# EAGLE design hc_05 (EAGLE 9.6.1)
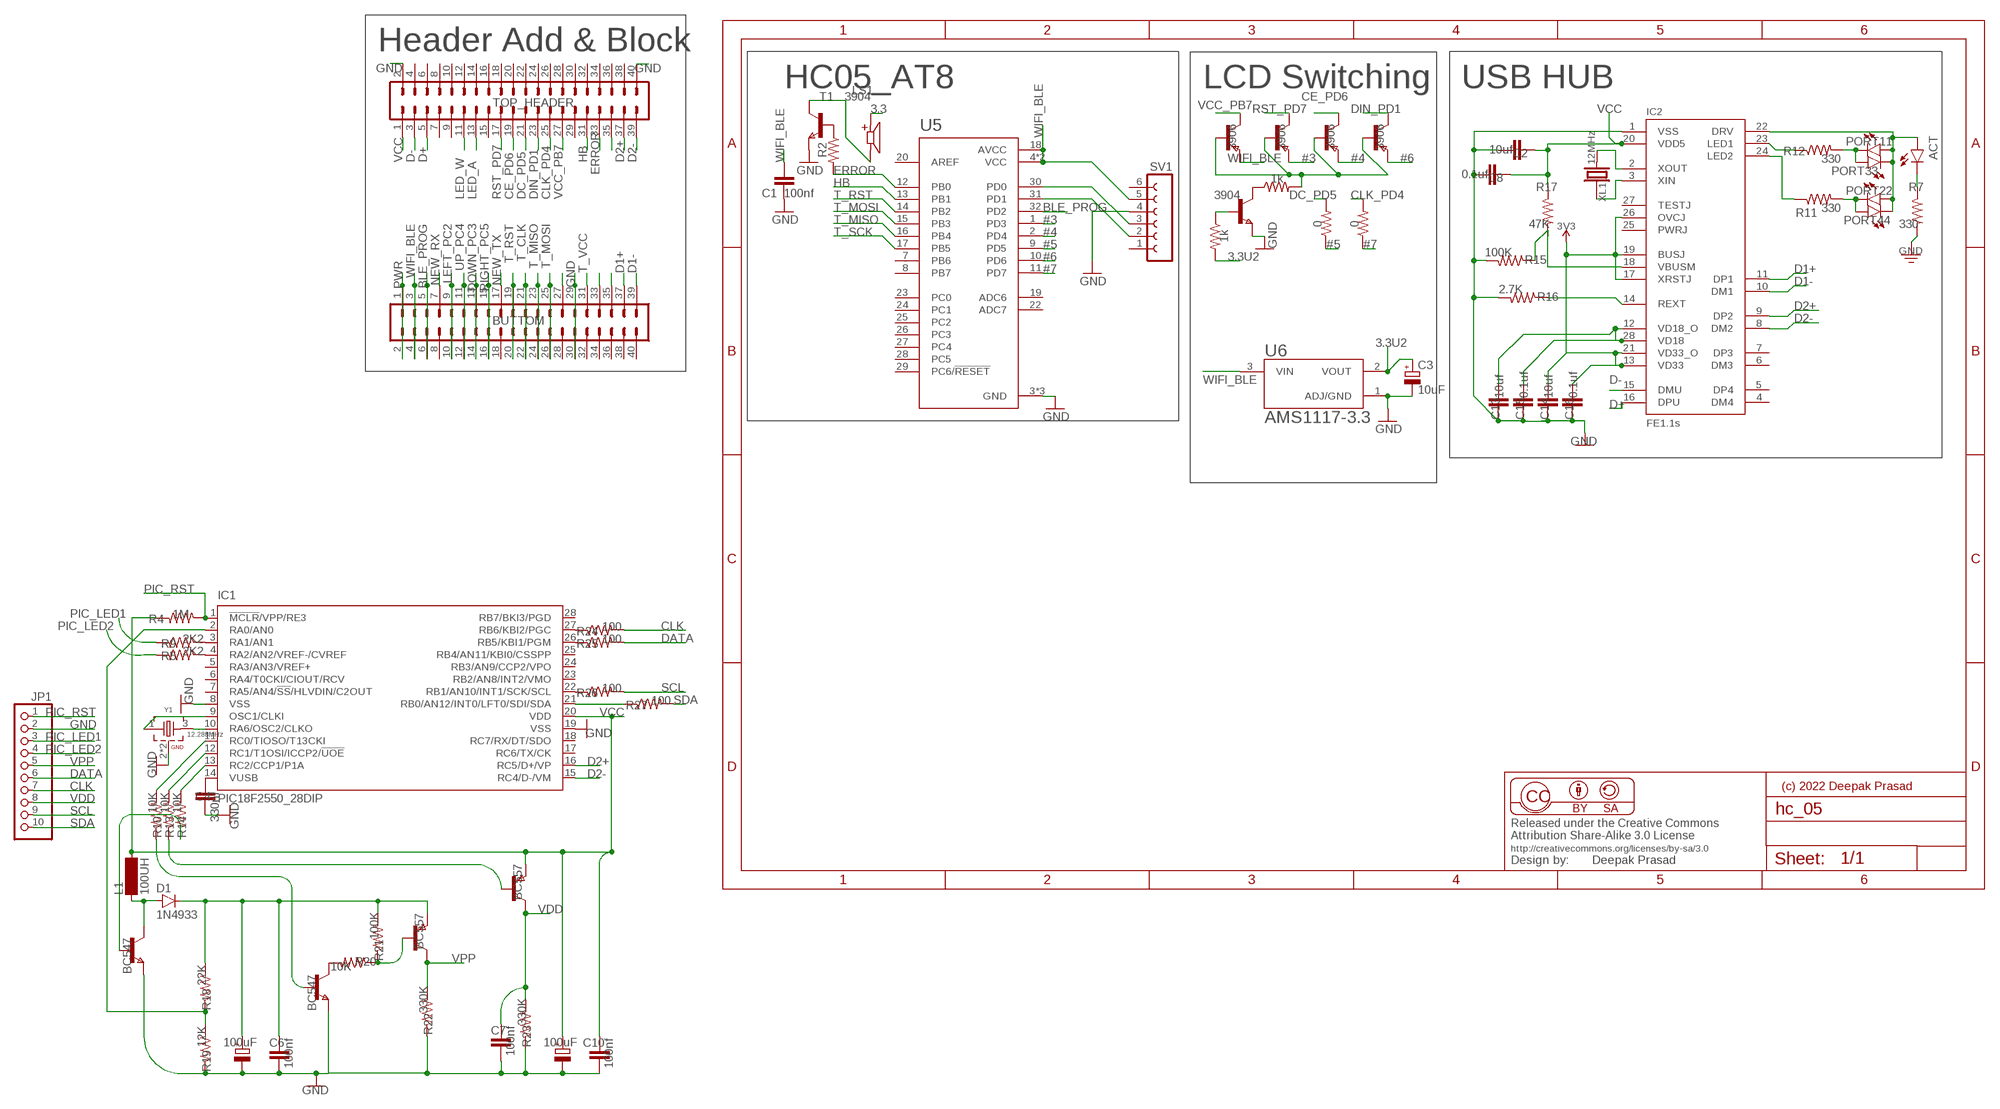
[diagram p0: schematic, sheet 1]

## Parts
ACT  LED1206  [LED-1206]
BUTTOM  MA20-2  [MA20-2]
C1  100nf  C-EUC1206  [C1206]
C2  10uf  C-EUC1206  [C1206]
C3  10uF  CPOL-EUC/6032-28R  [C/6032-28R]
C4  330nf  C-EUC1206  [C1206]
C5  100uF  CPOL-EUC/6032-28R  [C/6032-28R]
C6  100nf  C-EUC1206  [C1206]
C7  100nf  C-EUC1206  [C1206]
C8  0.1uf  C-EUC1206  [C1206]
C9  100uF  CPOL-EUC/6032-28R  [C/6032-28R]
C10  100nf  C-EUC1206  [C1206]
C13  10uf  C-EUC1206  [C1206]
C14  10uf  C-EUC1206  [C1206]
C15  0.1uf  C-EUC1206  [C1206]
C16  0.1uf  C-EUC1206  [C1206]
D1  1N4933  D-SMB  [SMB]
IC1  PIC18F2550_28DIP  [DIL28-3]
IC2  FE1.1S  [FE1.1S_SSOP-28]
JP1  PINHD-1X10  [1X10]
L1  100UH  MS85  [MS85]
LS1  CMT-8530S-SMT  [CUI_CMT-8530S-SMT]
PORT11  LED1206  [LED-1206]
PORT22  LED1206  [LED-1206]
PORT33  LED1206  [LED-1206]
PORT44  LED1206  [LED-1206]
R1  1k  R-US_CHIP-1206(3216-METRIC)  [RESC3216X70]
R2  22  R-US_CHIP-1206(3216-METRIC)  [RESC3216X70]
R3  0  R-US_CHIP-1206(3216-METRIC)  [RESC3216X70]
R4  1M  R-US_CHIP-1206(3216-METRIC)  [RESC3216X70]
R5  2K2  R-US_CHIP-1206(3216-METRIC)  [RESC3216X70]
R6  1k  R-US_CHIP-1206(3216-METRIC)  [RESC3216X70]
R7  330  R-US_CHIP-1206(3216-METRIC)  [RESC3216X70]
R8  0  R-US_CHIP-1206(3216-METRIC)  [RESC3216X70]
R9  2K2  R-US_CHIP-1206(3216-METRIC)  [RESC3216X70]
R10  10K  R-US_CHIP-1206(3216-METRIC)  [RESC3216X70]
R11  330  R-US_CHIP-1206(3216-METRIC)  [RESC3216X70]
R12  330  R-US_CHIP-1206(3216-METRIC)  [RESC3216X70]
R13  10K  R-US_CHIP-1206(3216-METRIC)  [RESC3216X70]
R14  10K  R-US_CHIP-1206(3216-METRIC)  [RESC3216X70]
R15  100K  R-US_CHIP-1206(3216-METRIC)  [RESC3216X70]
R16  2.7K  R-US_CHIP-1206(3216-METRIC)  [RESC3216X70]
R17  47K  R-US_CHIP-1206(3216-METRIC)  [RESC3216X70]
R18  22K  R-US_CHIP-1206(3216-METRIC)  [RESC3216X70]
R19  12K  R-US_CHIP-1206(3216-METRIC)  [RESC3216X70]
R20  10K  R-US_CHIP-1206(3216-METRIC)  [RESC3216X70]
R21  100K  R-US_CHIP-1206(3216-METRIC)  [RESC3216X70]
R22  330K  R-US_CHIP-1206(3216-METRIC)  [RESC3216X70]
R23  330K  R-US_CHIP-1206(3216-METRIC)  [RESC3216X70]
R24  100  R-US_CHIP-1206(3216-METRIC)  [RESC3216X70]
R25  100  R-US_CHIP-1206(3216-METRIC)  [RESC3216X70]
R26  100  R-US_CHIP-1206(3216-METRIC)  [RESC3216X70]
R27  100  R-US_CHIP-1206(3216-METRIC)  [RESC3216X70]
SV1  FE06-1  [FE06]
T1  3904  NPNSOT23  [SOT-23]
T2  3904  NPNSOT23  [SOT-23]
T3  3906  PNPSOT23  [SOT-23]
T4  3906  PNPSOT23  [SOT-23]
T5  3906  PNPSOT23  [SOT-23]
T6  3906  PNPSOT23  [SOT-23]
T7  BC547  NPNSOT23  [SOT-23]
T8  BC557  PNPSOT23  [SOT-23]
T9  BC547  NPNSOT23  [SOT-23]
T10  BC557  PNPSOT23  [SOT-23]
TOP_HEADER  MA20-2  [MA20-2]
U5  ATMEGA328P-AU  [QFP80P900X900X120-32N]
U6  AMS1117-3.3  [SOT229P700X180-4N]
XL1  12MHz  CRYSTALHC49UP  [HC49UP]
Y1  12.288MHz  WE-XTAL_CFPX-104_830059523  [WE-XTAL_CFPX-104]

## Nets
3.3: LS1.P
3.3U2: C3.+ R6.2 U6.2(VOUT)
3V3: C14.2 C16.2 IC2.13(VD33) IC2.17(XRSTJ) IC2.19(BUSJ) IC2.21(VD33_O) IC2.26(OVCJ)
#3: T4.2(E) U5.1(PD3)
#4: T5.2(E) U5.2(PD4)
#5: R8.1 U5.9(PD5)
#6: T6.2(E) U5.10(PD6)
#7: R3.1 U5.11(PD7)
BLE_PROG: BUTTOM.5 BUTTOM.6 U5.32(PD2)
CE_PD6: T5.1(C) TOP_HEADER.19
CLK: JP1.7 R24.2
CLK_PD4: R3.2 TOP_HEADER.25
D1+: BUTTOM.37 IC2.11(DP1)
D1-: BUTTOM.39 IC2.10(DM1)
D2+: IC1.16(RC5/D+/VP) IC2.9(DP2) TOP_HEADER.37
D2-: IC1.15(RC4/D-/VM) IC2.8(DM2) TOP_HEADER.39
D+: IC2.16(DPU) TOP_HEADER.5
D-: IC2.15(DMU) TOP_HEADER.3
DATA: JP1.6 R25.2
DC_PD5: R8.2 TOP_HEADER.21
DIN_PD1: T6.1(C) TOP_HEADER.23
DOWN_PC3: BUTTOM.13 BUTTOM.14
ERROR: R2.2 TOP_HEADER.33 U5.12(PB0)
GND [POWER]: BUTTOM.29 BUTTOM.30 C1.1 C2.2 C3.- C4.1 C5.- C6.1 C7.1 C8.2 C9.- C10.1 C13.1 C14.1 C15.1 C16.1 IC1.8(VSS) IC1.19(VSS) IC2.1(VSS) JP1.2 R7.2 R15.2 R16.2 R19.1 R22.1 R23.1 SV1.4 T1.2(E) T2.2(E) T7.2(E) T9.2(E) TOP_HEADER.2 TOP_HEADER.40 U5.3(GND) U5.5(GND) U5.21(GND) U6.1(ADJ/GND) Y1.2(GND) Y1.4(GND)
HB: TOP_HEADER.31 U5.13(PB1)
LED_A: TOP_HEADER.13
LED_W: TOP_HEADER.11
LEFT_PC2: BUTTOM.9 BUTTOM.10
N$1: R1.1 T2.1(C)
N$2: R1.2 T3.3(B) T4.3(B) T5.3(B) T6.3(B)
N$3: IC1.27(RB6/KBI2/PGC) R24.1
N$4: R2.1 T1.3(B)
N$5: IC1.4(RA2/AN2/VREF-/CVREF) R5.2
N$6: IC1.3(RA1/AN1) R9.2
N$7: IC1.9(OSC1/CLKI) Y1.1
N$8: IC1.10(RA6/OSC2/CLKO) Y1.3
N$9: IC1.11(RC0/TIOSO/T13CKI) R10.2
N$10: IC1.12(RC1/T1OSI/ICCP2/!UOE) R13.2
N$11: IC1.13(RC2/CCP1/P1A) R14.2
N$12: C4.2 IC1.14(VUSB)
N$13: R10.1 T9.3(B)
N$14: SV1.2 U5.31(PD1)
N$15: SV1.3 U5.30(PD0)
N$16: R6.1 T2.3(B)
N$17: IC2.14(REXT) R16.1
N$18: ACT.C R7.1
N$19: D1.2(A) L1.1 T7.1(C)
N$20: C13.2 C15.2 IC2.12(VD18_O) IC2.28(VD18)
N$21: C5.+ C6.2 D1.1(C) R18.2 R21.2 T10.2(E)
N$22: R14.1 T7.3(B)
N$23: LS1.N T1.1(C)
N$24: IC2.23(LED1) R12.1
N$25: IC2.2(XOUT) XL1.2
N$26: IC2.3(XIN) XL1.1
N$27: PORT11.C PORT33.A R12.2
N$28: PORT22.C PORT44.A R11.2
N$29: IC1.2(RA0/AN0) R18.1 R19.2
N$30: R13.1 T8.3(B)
N$31: R20.2 T9.1(C)
N$32: TOP_HEADER.35
N$33: R20.1 R21.1 T10.3(B)
N$34: IC1.26(RB5/KBI1/PGM) R25.1
N$35: IC1.22(RB1/AN10/INT1/SCK/SCL) R26.1
N$36: IC1.21(RB0/AN12/INT0/LFT0/SDI/SDA) R27.1
N$38: IC2.18(VBUSM) R15.1 R17.2
N$41: BUTTOM.27
N$44: BUTTOM.33
N$45: BUTTOM.35
N$48: IC2.24(LED2) R11.1
N$49: ACT.A IC2.22(DRV) PORT11.A PORT22.A PORT33.C PORT44.C
NEW_RX: BUTTOM.7
NEW_TX: BUTTOM.17
PIC_LED1: JP1.3 R9.1
PIC_LED2: JP1.4 R5.1
PIC_RST: IC1.1(!MCLR!/VPP/RE3) JP1.1 R4.2
PWR: BUTTOM.1 BUTTOM.2
RIGHT_PC5: BUTTOM.15 BUTTOM.16
RST_PD7: T4.1(C) TOP_HEADER.17
SCL: JP1.9 R26.2
SDA: JP1.10 R27.2
T_CLK: BUTTOM.21 BUTTOM.22
T_MISO: BUTTOM.23 BUTTOM.24 U5.16(PB4)
T_MOSI: BUTTOM.25 BUTTOM.26 U5.15(PB3)
T_RST: BUTTOM.19 BUTTOM.20 U5.14(PB2)
T_SCK: U5.17(PB5)
T_VCC: BUTTOM.31
UP_PC4: BUTTOM.11 BUTTOM.12
VCC [POWER]: C2.1 C8.1 C9.+ C10.2 IC1.20(VDD) IC2.20(VDD5) L1.2 R4.1 R17.1 T8.2(E) TOP_HEADER.1
VCC_PB7: T3.1(C) TOP_HEADER.27
VDD: C7.2 JP1.8 R23.2 T8.1(C)
VPP: JP1.5 R22.2 T10.1(C)
WIFI_BLE: BUTTOM.3 BUTTOM.4 C1.2 SV1.5 T3.2(E) U5.4(VCC) U5.6(VCC) U5.18(AVCC) U6.3(VIN)
Unconnected: BUTTOM.8 BUTTOM.18 BUTTOM.28 BUTTOM.32 BUTTOM.34 BUTTOM.36 BUTTOM.38 BUTTOM.40 IC1.5(RA3/AN3/VREF+) IC1.6(RA4/T0CKI/CIOUT/RCV) IC1.7(RA5/AN4/!SS!/HLVDIN/C2OUT) IC1.17(RC6/TX/CK) IC1.18(RC7/RX/DT/SDO) IC1.23(RB2/AN8/INT2/VMO) IC1.24(RB3/AN9/CCP2/VPO) IC1.25(RB4/AN11/KBI0/CSSPP) IC1.28(RB7/BKI3/PGD) IC2.4(DM4) IC2.5(DP4) IC2.6(DM3) IC2.7(DP3) IC2.25(PWRJ) IC2.27(TESTJ) SV1.1 SV1.6 TOP_HEADER.4 TOP_HEADER.6 TOP_HEADER.7 TOP_HEADER.8 TOP_HEADER.9 TOP_HEADER.10 TOP_HEADER.12 TOP_HEADER.14 TOP_HEADER.15 TOP_HEADER.16 TOP_HEADER.18 TOP_HEADER.20 TOP_HEADER.22 TOP_HEADER.24 TOP_HEADER.26 TOP_HEADER.28 TOP_HEADER.29 TOP_HEADER.30 TOP_HEADER.32 TOP_HEADER.34 TOP_HEADER.36 TOP_HEADER.38 U5.7(PB6) U5.8(PB7) U5.19(ADC6) U5.20(AREF) U5.22(ADC7) U5.23(PC0) U5.24(PC1) U5.25(PC2) U5.26(PC3) U5.27(PC4) U5.28(PC5) U5.29(PC6/!RESET)

## Notes on the sheet
- Header Add & Block
- HC05_AT8 | LCD Switching | USB HUB
- (c) 2022 Deepak Prasad

## Library data of the parts
ACT PORT11 PORT22 PORT33 PORT44 = SparkFun-LED:LED: LED (Generic) Standard schematic elements and footprints for 5mm, 3mm, 1206, and 0603 sized LEDs. Generic LEDs with no color specified.
BUTTOM TOP_HEADER = con-lstb:MA20-2: PIN HEADER; OC_FARNELL: unknown; OC_NEWARK: unknown
C1 C2 C4 C6-C8 C10 C13-C16 = rcl:C-EU: CAPACITOR, European symbol; SPICEPREFIX: C
C3 C5 C9 = rcl:CPOL-EU: POLARIZED CAPACITOR, European symbol
D1 = semicon-smd-ipc:D-: DIODE unfilled
IC1 = microchip:PIC18F2*_28: USB Microcontrollers with nanoWatt Technology High-Performance, Enhanced Flash, 28/40/44-Pin, Source: http://ww1.microchip.com/downloads/en/devicedoc/39632c.pdf; MF: MICROCHIP; MPN: PIC18F2550-I/SP; OC_FARNELL: 1523822; OC_NEWARK: 80K6054
IC2 = Ai_IC:FE1.1S
JP1 = pinhead:PINHD-1X10: PIN HEADER
L1 = inductor-neosid:MS85: INDUCTOR SMD power inductor; OC_FARNELL: unknown; OC_NEWARK: unknown
LS1 = CMT-8530S-SMT:CMT-8530S-SMT: 8.5 mm, 3.6 Vo-p, 90 dB, Surface Mount (SMT), Magnetic Audio Transducer Buzzer Check availability <https://pricing.snapeda.com/parts/CMT-8530S-SMT-TR/CUI%20Devices/view-part?ref=eda>; AVAILABILITY: In Stock; CUI_PURCHASE_URL: https://www.cuidevices.com/product/audio/buzzers/audio-transducers/cmt-8530s-smt-tr?utm_source=snapeda.com&utm_medium=referral&utm_campaign=snapedaBOM; DESCRIPTION: 8.5 mm, 3.6 Vo-p, 90 dB, Surface Mount (SMT), Magnetic Audio Transducer Buzzer; MF: CUI Devices; MP: CMT-8530S-SMT-TR; PACKAGE: None; PRICE: None; PURCHASE-URL: https://pricing.snapeda.com/search/part/CMT-8530S-SMT-TR/?ref=eda
R1-R27 = Resistor:R-US: Resistor Fixed - ANSI; CATEGORY: Resistor; SUB-CATEGORY: Fixed
SV1 = con-lsta:FE06-1: FEMALE HEADER; OC_FARNELL: unknown; OC_NEWARK: unknown
T1 T2 T7 T9 = zetex:NPNSOT23: NPN TRANSISTOR; MPN: DSS20201L-7; OC_FARNELL: 1710688; OC_NEWARK: 25R4555
T3-T6 T8 T10 = zetex:PNPSOT23: PNP TRANSISTOR; MPN: DSS20200L-7; OC_FARNELL: unknown; OC_NEWARK: 25R4554
U5 = ATMEGA328P-AU:ATMEGA328P-AU: ATmega Series 20 MHz 32 KB Flash 2 KB SRAM 8-Bit Microcontroller - TQFP-32 Check availability <https://pricing.snapeda.com/parts/ATMEGA328P-AU/Microchip%20Technology/view-part?ref=eda>; AVAILABILITY: In Stock; DESCRIPTION: AVR AVR® ATmega Microcontroller IC 8-Bit 20MHz 32KB (16K x 16) FLASH 32-TQFP (7x7); MF: Microchip Technology; MP: ATMEGA328P-AU; PACKAGE: TQFP-32 Microchip; PRICE: None; PURCHASE-URL: https://pricing.snapeda.com/search/part/ATMEGA328P-AU/?ref=eda
U6 = AMS1117-3.3:AMS1117-3.3: Sot223/Pkg 1-Amp 3.3-Volt Low Drop Out Voltage Regulatator Check availability <https://pricing.snapeda.com/parts/AMS1117-3.3/Advanced%20Monolithic%20Systems/view-part?ref=eda>; AVAILABILITY: In Stock; DESCRIPTION: Sot223/Pkg 1-Amp 3.3-Volt Low Drop Out Voltage Regulatator; MF: Advanced Monolithic Systems; MP: AMS1117-3.3; PACKAGE: SOT-223 Seeed Technology; PRICE: None
XL1 = Ai_FrequencyControl:CRYSTAL: PTH: ... SMD: ... Cylinder: CMR200T-32.768KDZBT
Y1 = Wurth_Quartz Crystals & Oscillators_WE-XTAL:WE-XTAL_CFPX-104: WE-XTAL Quartz Crystal Characteristics SMT and THT models Hermetically sealed Frequencies between 1.8432 MHz and 50 MHz Tolerances down to ±10 ppm available Maximum operating temperatures range: -40 °C to 85 °C Stabilities down to ±10 ppm available Applications Microprocessor Wireless Communication Devices Industrial Devices Wired Communication (e.g. Ethernet and USB) IoT Optical Network Audio and Multimedia Devices Test and Measurement Equipment Navigation and Locators Wearables <https://www.we-online.com/catalog/media/o135919v209%20Family_WE-XTAL_IQXC-42.jpg> Details see: https://www.we-online.com/catalog/en/WE-XTAL Updated by Ella Wu , 2020-11-23 2020 (C) Wurth Elektronik; C-LOAD: 18pF; DATASHEET-URL: https://www.we-online.com/catalog/datasheet/830059523.pdf; MOUNT: SMT; PART-NUMBER: 830059523; STABILITY: 30ppm; TOLERANCE: ±20ppm

## Net classes
0 default: width 0.254 mm, clearance 0.254 mm
1 POWER: width 0.254 mm, clearance 0.254 mm

## Board
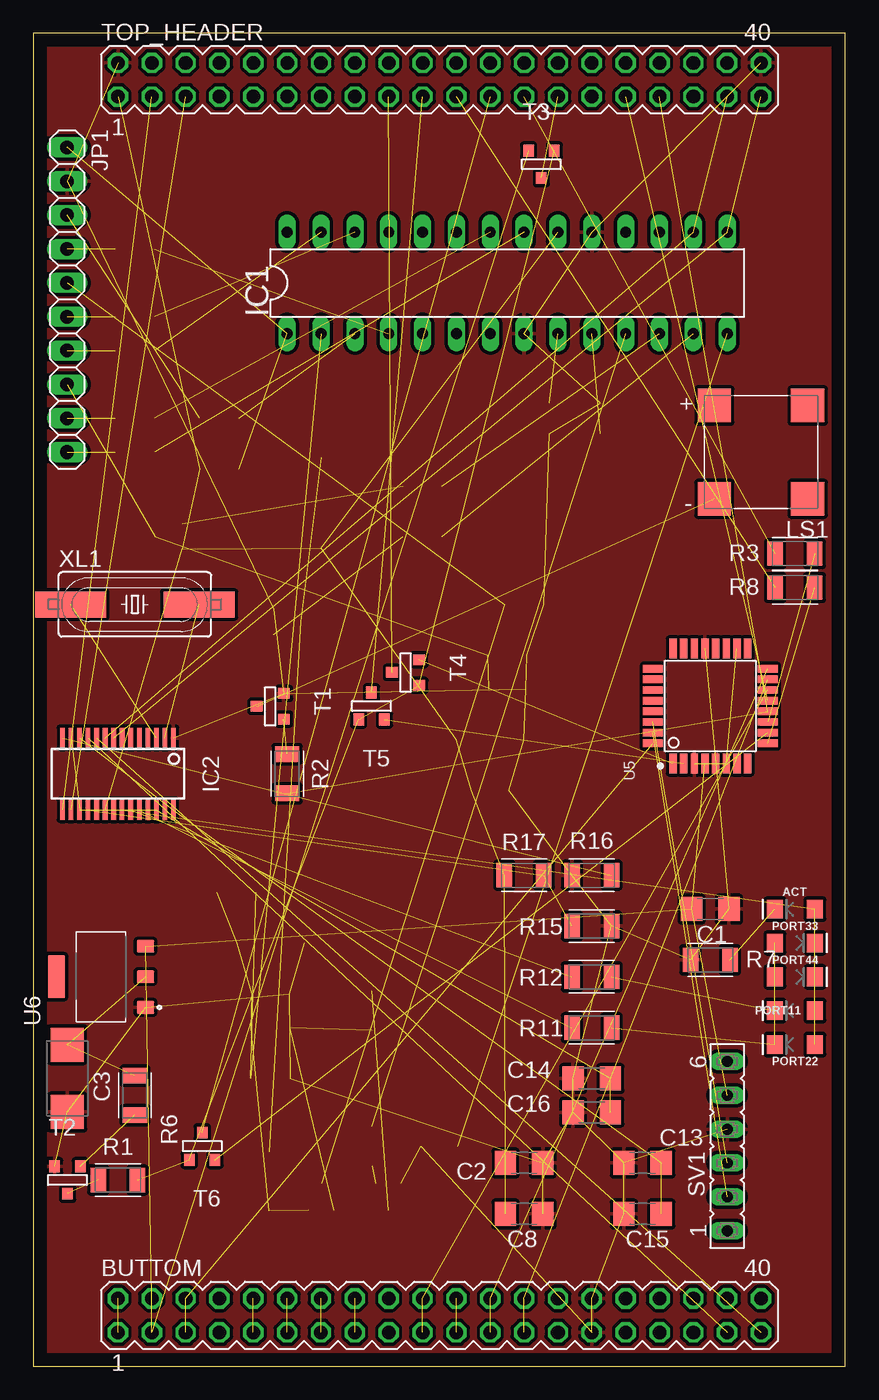
[diagram p1: board, top side]
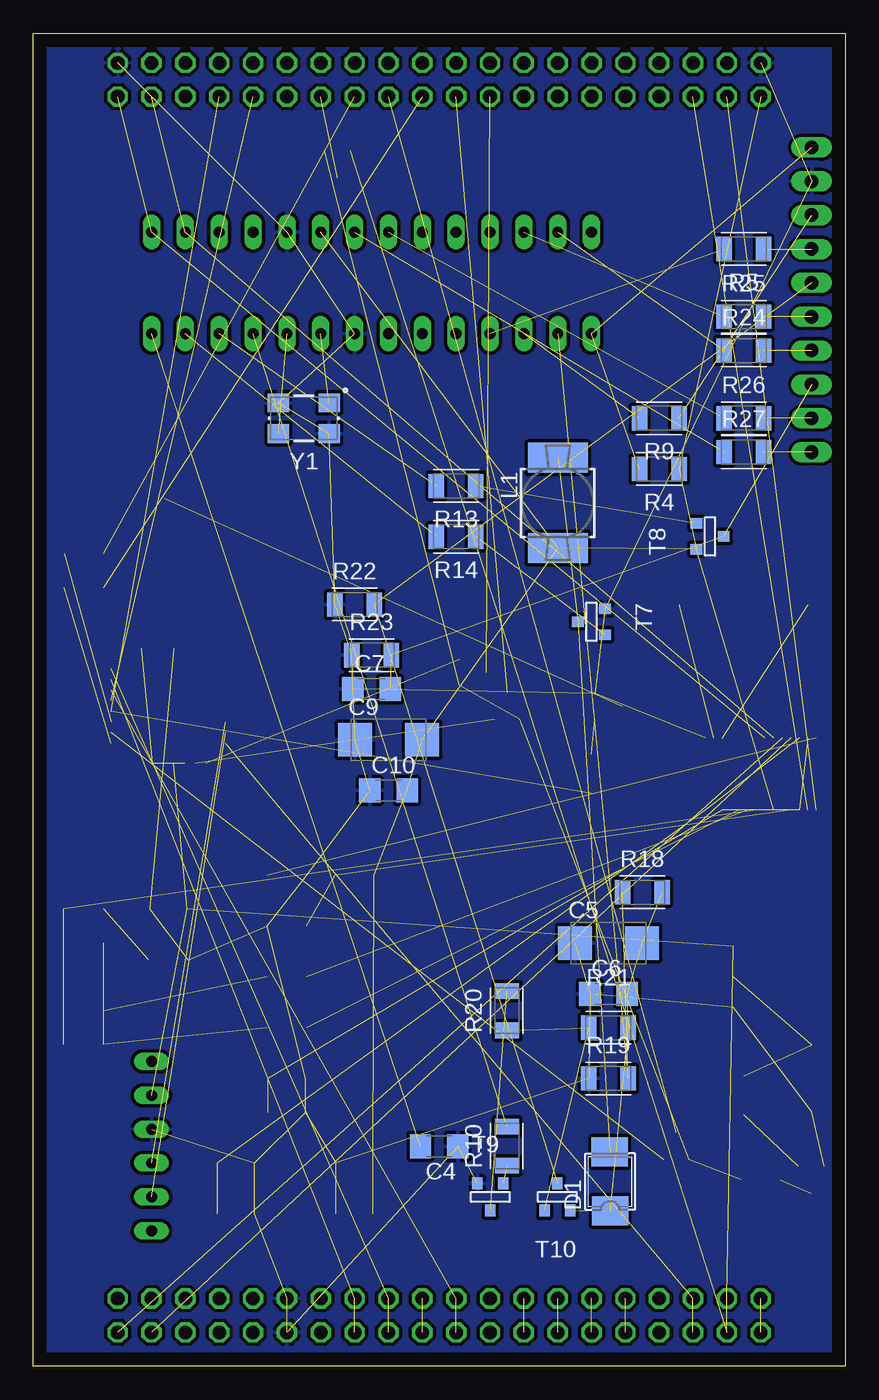
[diagram p2: board, bottom side, seen from below]

Size 60.94 x 100 mm. Coordinates in mm from the lower left corner, seen from the top.
Outline: 0,0 60.94,0 60.94,100 0,100 0,0
Copper layers (1*16): Top 0.035mm / dielectric 1.5mm / Bottom 0.035mm
Design rules "default": minimum track width 6mil, minimum drill 0.35mm, track to track 6mil, track to pad 6mil, pad to pad 6mil, via to via 6mil, smd to smd 6mil, copper to edge 40mil, drill to drill 6mil, minimum pad ring 10mil, minimum via ring 8mil, stop-mask expansion 4mil, vias tented up to drill 0mil, thermal gap 10mil

### Footprints (pad centres in the part's own frame; a part is rotated, then mirrored left to right if it is on the bottom)
LED-1206 = smd 1.2 x 1.4: A -1.5,0; C 1.5,0
MA20-2 = drill 1.016 octagon: 1 -24.13,-1.27; 2 -24.13,1.27; 3 -21.59,-1.27; 4 -21.59,1.27; 5 -19.05,-1.27; 6 -19.05,1.27; 7 -16.51,-1.27; 8 -16.51,1.27; 9 -13.97,-1.27; 10 -13.97,1.27; 11 -11.43,-1.27; 12 -11.43,1.27; 13 -8.89,-1.27; 14 -8.89,1.27; 15 -6.35,-1.27; 16 -6.35,1.27; 17 -3.81,-1.27; 18 -3.81,1.27; 19 -1.27,-1.27; 20 -1.27,1.27; 21 1.27,-1.27; 22 1.27,1.27; 23 3.81,-1.27; 24 3.81,1.27; 25 6.35,-1.27; 26 6.35,1.27; 27 8.89,-1.27; 28 8.89,1.27; 29 11.43,-1.27; 30 11.43,1.27; 31 13.97,-1.27; 32 13.97,1.27; 33 16.51,-1.27; 34 16.51,1.27; 35 19.05,-1.27; 36 19.05,1.27; 37 21.59,-1.27; 38 21.59,1.27; 39 24.13,-1.27; 40 24.13,1.27
C1206 = smd 1.6 x 1.8: 1 -1.4,0; 2 1.4,0
C/6032-28R = smd 2.55 x 2.5: + 2.525,0; - -2.525,0
SMB = smd 2.159 x 2.743: 1 -2.311,-0.127; 2 2.108,-0.102
DIL28-3 = drill 0.813 long: 1 -16.51,-3.81; 2 -13.97,-3.81; 3 -11.43,-3.81; 4 -8.89,-3.81; 5 -6.35,-3.81; 6 -3.81,-3.81; 7 -1.27,-3.81; 8 1.27,-3.81; 9 3.81,-3.81; 10 6.35,-3.81; 11 8.89,-3.81; 12 11.43,-3.81; 13 13.97,-3.81; 14 16.51,-3.81; 15 16.51,3.81; 16 13.97,3.81; 17 11.43,3.81; 18 8.89,3.81; 19 6.35,3.81; 20 3.81,3.81; 21 1.27,3.81; 22 -1.27,3.81; 23 -3.81,3.81; 24 -6.35,3.81; 25 -8.89,3.81; 26 -11.43,3.81; 27 -13.97,3.81; 28 -16.51,3.81
FE1.1S_SSOP-28 = smd 0.35 x 1.5: 1 -4.16,-2.7; 2 -3.52,-2.7; 3 -2.88,-2.7; 4 -2.24,-2.7; 5 -1.6,-2.7; 6 -0.96,-2.7; 7 -0.32,-2.7; 8 0.32,-2.7; 9 0.96,-2.7; 10 1.6,-2.7; 11 2.24,-2.7; 12 2.88,-2.7; 13 3.52,-2.7; 14 4.16,-2.7; 15 4.16,2.7; 16 3.52,2.7; 17 2.88,2.7; 18 2.24,2.7; 19 1.6,2.7; 20 0.96,2.7; 21 0.32,2.7; 22 -0.3,2.7; 23 -0.96,2.7; 24 -1.6,2.7; 25 -2.24,2.7; 26 -2.88,2.7; 27 -3.52,2.7; 28 -4.16,2.7
1X10 = drill 1.016 long: 1 -11.43,0; 2 -8.89,0; 3 -6.35,0; 4 -3.81,0; 5 -1.27,0; 6 1.27,0; 7 3.81,0; 8 6.35,0; 9 8.89,0; 10 11.43,0
MS85 = smd 4.5 x 2.25: 1 0,-3.383; 2 0,3.383
CUI_CMT-8530S-SMT = smd 2.5 x 2.5: 1 -3.5,3.5; 2 -3.5,-3.5; N 3.5,3.5; P 3.5,-3.5
RESC3216X70 = smd 1.165 x 1.815: 1 -1.475,0; 2 1.475,0
FE06 = drill 0.813 long: 1 -6.35,0; 2 -3.81,0; 3 -1.27,0; 4 1.27,0; 5 3.81,0; 6 6.35,0
SOT-23 = smd 0.787 x 0.889: 1 0.025,-1.016; 2 -0.94,1.016; 3 0.991,1.016
QFP80P900X900X120-32N = smd 1.5 x 0.55: 1 -4.3,2.8; 2 -4.3,2; 3 -4.3,1.2; 4 -4.3,0.4; 5 -4.3,-0.4; 6 -4.3,-1.2; 7 -4.3,-2; 8 -4.3,-2.8; 17 4.3,-2.8; 18 4.3,-2; 19 4.3,-1.2; 20 4.3,-0.4; 21 4.3,0.4; 22 4.3,1.2; 23 4.3,2; 24 4.3,2.8 | smd 0.55 x 1.5: 9 -2.8,-4.3; 10 -2,-4.3; 11 -1.2,-4.3; 12 -0.4,-4.3; 13 0.4,-4.3; 14 1.2,-4.3; 15 2,-4.3; 16 2.8,-4.3; 25 2.8,4.3; 26 2,4.3; 27 1.2,4.3; 28 0.4,4.3; 29 -0.4,4.3; 30 -1.2,4.3; 31 -2,4.3; 32 -2.8,4.3
SOT229P700X180-4N = smd 0.93 x 1.31: 1 -2.29,-3.345; 2 0,-3.345; 3 2.29,-3.345 | smd 3.24 x 1.31: 4 0,3.345
HC49UP = smd 5.334 x 1.93: 1 -4.826,0; 2 4.826,0
WE-XTAL_CFPX-104 = smd 1.6 x 1.4: 1 -1.9,-1.15; 2 1.9,-1.15; 3 1.9,1.15; 4 -1.9,1.15

### Placement (x,y rotation side)
ACT  57.15,34.29 180 top
BUTTOM  30.48,3.81 0 top
C1  50.8,34.29 180 top
C2  36.83,15.24 0 top
C3  2.54,21.59 90 top
C4  30.48,16.51 180 bottom
C5  17.78,31.75 0 bottom
C6  17.78,27.94 0 bottom
C7  35.56,50.8 0 bottom
C8  36.83,11.43 0 top
C9  34.29,46.99 0 bottom
C10  34.29,43.18 0 bottom
C13  45.72,15.24 0 top
C14  41.91,21.59 0 top
C15  45.72,11.43 0 top
C16  41.91,19.05 0 top
D1  17.78,13.97 90 bottom
IC1  35.56,81.28 0 top
IC2  6.35,44.45 180 top
JP1  2.54,80.01 270 top
L1  21.59,64.77 180 bottom
LS1  54.61,68.58 180 top
PORT11  57.15,26.67 180 top
PORT22  57.15,24.13 180 top
PORT33  57.15,31.75 0 top
PORT44  57.15,29.21 0 top
R1  6.35,13.97 0 top
R2  19.05,44.45 270 top
R3  57.15,60.96 180 top
R4  13.97,67.31 180 bottom
R5  7.62,83.82 180 bottom
R6  7.62,20.32 90 top
R7  50.8,30.48 180 top
R8  57.15,58.42 180 top
R9  13.97,71.12 180 bottom
R10  25.4,16.51 90 bottom
R11  41.91,25.4 0 top
R12  41.91,29.21 0 top
R13  29.21,66.04 180 bottom
R14  29.21,62.23 180 bottom
R15  41.91,33.02 0 top
R16  41.91,36.83 180 top
R17  36.83,36.83 0 top
R18  15.24,35.56 0 bottom
R19  17.78,21.59 0 bottom
R20  25.4,26.67 90 bottom
R21  17.78,25.4 0 bottom
R22  36.83,57.15 0 bottom
R23  35.56,53.34 0 bottom
R24  7.62,76.2 0 bottom
R25  7.62,78.74 0 bottom
R26  7.62,71.12 0 bottom
R27  7.62,68.58 0 bottom
SV1  52.07,16.51 90 top
T1  17.78,49.53 270 top
T2  2.54,13.97 0 top
T3  38.1,90.17 0 top
T4  27.94,52.07 270 top
T5  25.4,49.53 180 top
T6  12.7,16.51 180 top
T7  19.05,55.88 270 bottom
T8  10.16,62.23 90 bottom
T9  26.67,12.7 0 bottom
T10  21.59,12.7 180 bottom
TOP_HEADER  30.48,96.52 0 top
U5  50.8,49.53 90 top
U6  5.08,29.21 90 top
XL1  7.62,57.15 0 top
Y1  40.64,71.12 180 bottom

### Tracks (layer width: path | path; a pad name or v marks a point on that pad's centre or on a via)
3.3U2  (2 unrouted)
3V3  (6 unrouted)
#3  (1 unrouted)
#4  (1 unrouted)
#5  (1 unrouted)
#6  (1 unrouted)
#7  (1 unrouted)
BLE_PROG  (2 unrouted)
CE_PD6  (1 unrouted)
CLK  (1 unrouted)
CLK_PD4  (1 unrouted)
D1+  (1 unrouted)
D1-  (1 unrouted)
D2+  (2 unrouted)
D2-  (2 unrouted)
D+  (1 unrouted)
D-  (1 unrouted)
DATA  (1 unrouted)
DC_PD5  (1 unrouted)
DIN_PD1  (1 unrouted)
DOWN_PC3  (1 unrouted)
ERROR  (2 unrouted)
GND  (38 unrouted)
  pour Top (isolate 0.254): 0,100.33 0,0 60.96,0 60.96,99.06 62.23,100.33 1.27,100.33
  pour Bottom (isolate 0.254): 0,100.33 0,0 60.96,0 60.96,100.33
HB  (1 unrouted)
LEFT_PC2  (1 unrouted)
N$1  (1 unrouted)
N$2  (4 unrouted)
N$3  (1 unrouted)
N$4  (1 unrouted)
N$5  (1 unrouted)
N$6  (1 unrouted)
N$7  (1 unrouted)
N$8  (1 unrouted)
N$9  (1 unrouted)
N$10  (1 unrouted)
N$11  (1 unrouted)
N$12  (1 unrouted)
N$13  (1 unrouted)
N$14  (1 unrouted)
N$15  (1 unrouted)
N$16  (1 unrouted)
N$17  (1 unrouted)
N$18  (1 unrouted)
N$19  (2 unrouted)
N$20  (3 unrouted)
N$21  (5 unrouted)
N$22  (1 unrouted)
N$23  (1 unrouted)
N$24  (1 unrouted)
N$25  (1 unrouted)
N$26  (1 unrouted)
N$27  (2 unrouted)
N$28  (2 unrouted)
N$29  (2 unrouted)
N$30  (1 unrouted)
N$31  (1 unrouted)
N$33  (2 unrouted)
N$34  (1 unrouted)
N$35  (1 unrouted)
N$36  (1 unrouted)
N$38  (2 unrouted)
N$48  (1 unrouted)
N$49  (5 unrouted)
PIC_LED1  (1 unrouted)
PIC_LED2  (1 unrouted)
PIC_RST  (2 unrouted)
PWR  (1 unrouted)
RIGHT_PC5  (1 unrouted)
RST_PD7  (1 unrouted)
SCL  (1 unrouted)
SDA  (1 unrouted)
T_CLK  (1 unrouted)
T_MISO  (2 unrouted)
T_MOSI  (2 unrouted)
T_RST  (2 unrouted)
UP_PC4  (1 unrouted)
VCC  (10 unrouted)
VCC_PB7  (1 unrouted)
VDD  (3 unrouted)
VPP  (2 unrouted)
WIFI_BLE  (8 unrouted)